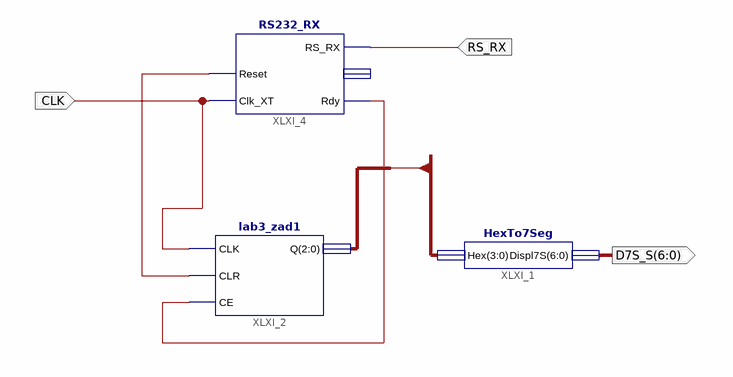
[diagram p0: schematic sheet 1]
// Xilinx ISE schematic rs.sch (xc9500xl) as structural Verilog: 3 symbols, 3 ports
module rs (
  input  CLK,
  input  RS_RX,
  output [6:0] D7S_S
);

  wire XLXN_22, XLXN_27;
  wire [3:0] X;

  RS232_RX XLXI_4 (.Reset(XLXN_22), .Clk_XT(CLK), .Rdy(XLXN_27), .RS_RX(RS_RX));  // open: DO
  HexTo7Seg XLXI_1 (.Hex(X), .Displ7S(D7S_S));
  lab3_zad1 XLXI_2 (.CLK(CLK), .CLR(XLXN_22), .CE(XLXN_27), .Q(X[2:0]));
endmodule
